# Altium project Motor_Controller.PrjPcb
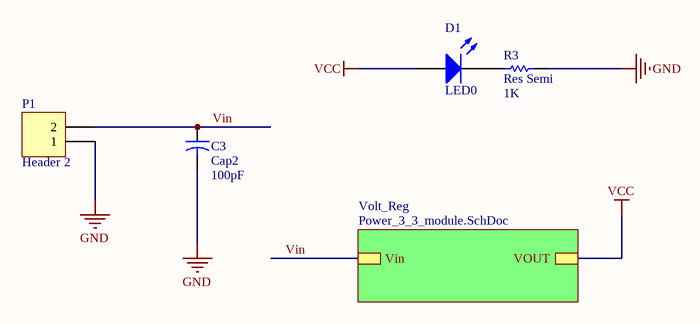
[diagram p0: Motor_Top_module.SchDoc]
2 sheets, 9 parts. Net scope: hierarchical (ports join the sheet entries above them; power ports are global).
Board file: Motor_Controller_rev1.PcbDoc
Sheets:
  Motor_Top_module.SchDoc
    Volt_Reg = Power_3_3_module.SchDoc

## Sheet Motor_Top_module.SchDoc
size A

### Parts
C3  Cap2  value 100pF  [CAPR5-4X5]
D1  LED0  [LED-0]
P1  Header 2  [HDR1X2]
R3  Res Semi  value 1K  [AXIAL-0.5]

### Sub-sheets
Volt_Reg = Power_3_3_module.SchDoc: Vin, VOUT

### Nets
GND: C3.2 P1.1 R3.2
VCC: D1.1(A) ; sheet Volt_Reg/VOUT
Vin: C3.1 P1.2 ; sheet Volt_Reg/Vin
NetD1_2: D1.2(K) R3.1

### Library data of the parts
C3 = Cap2: Capacitor; Published: 23-Sep-2002; PackageReference: CAPR5-4X5; Publisher: Altium Limited; PackageDescription: Capacitor; 2 Leads
D1 = LED0: Typical INFRARED GaAs LED; Published: 8-Jun-2000; LatestRevisionDate: 08-Jul-2005; LatestRevisionNote: Mech Layer 1 removed.; PackageReference: LED-0; Publisher: Altium Limited; PackageDescription: LED; 2 Leads
P1 = Header 2: Header, 2-Pin; LatestRevisionDate: 17-Jul-2002; LatestRevisionNote: Re-released for DXP Platform.; Publisher: Altium Limited
R3 = Res Semi: Semiconductor Resistor; Published: 8-Jun-2000; LatestRevisionDate: 17-Jul-2002; LatestRevisionNote: Re-released for DXP Platform.; PackageReference: AXIAL-0.5; Publisher: Altium Limited; PackageDescription: Axial Device, Thru-Hole; 2 Leads; 0.5 in Pin Spacing

## Sheet Power_3_3_module.SchDoc
size A
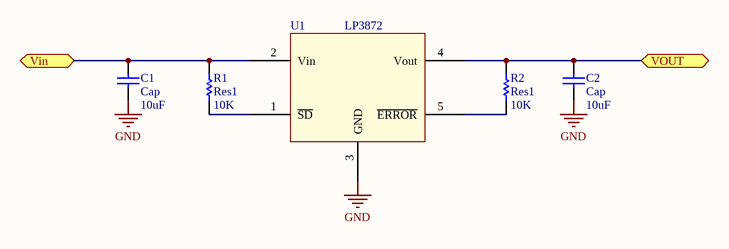
[diagram p1: Power_3_3_module.SchDoc]

### Parts
C1  Cap  value 10uF  [RESC6332]
C2  Cap  value 10uF  [RESC6332]
R1  Res1  value 10K  [RESC6332]
R2  Res1  value 10K  [RESC6332]
U1  LP3872  [SOT150P700X180-5N]

### Ports
Vin, VOUT

### Nets
GND: C1.2 C2.2 U1.3(GND)
VCC: C2.1 R2.2 U1.4(Vout) ; port VOUT
Vin: C1.1 R1.2 U1.2(Vin) ; port Vin
NetR1_1: R1.1 U1.1(~{SD})
NetR2_1: R2.1 U1.5(~{ERROR})

### Library data of the parts
C1 C2 = Cap: Capacitor; Published: 8-Jun-2000; LatestRevisionDate: 17-Jul-2002; LatestRevisionNote: Re-released for DXP Platform.; PackageReference: RAD-0.3; Publisher: Altium Limited; PackageDescription: Radial Cap, Thru-Hole; 2 Leads; 0.3 in Pin Spacing
R1 R2 = Res1: Resistor; Published: 8-Jun-2000; LatestRevisionDate: 17-Jul-2002; LatestRevisionNote: Re-released for DXP Platform.; PackageReference: AXIAL-0.3; Publisher: Altium Limited; PackageDescription: Axial Device, Thru-Hole; 2 Leads; 0.3 in Pin Spacing

## Nets that join several sheets
GND: Motor_Top_module (C3.2 P1.1 R3.2), Power_3_3_module (C1.2 C2.2 U1.3)
VCC: Motor_Top_module (D1.1), Power_3_3_module (C2.1 R2.2 U1.4)
Vin: Motor_Top_module (C3.1 P1.2), Power_3_3_module (C1.1 R1.2 U1.2)